# EasyEDA schematic easyeda-schematic.json
TITLE: 2key1 r2; REV: 1.0; Date: 2021-07-10; Sheet: 1/1; Drawn By: softplus; Company: Your Company
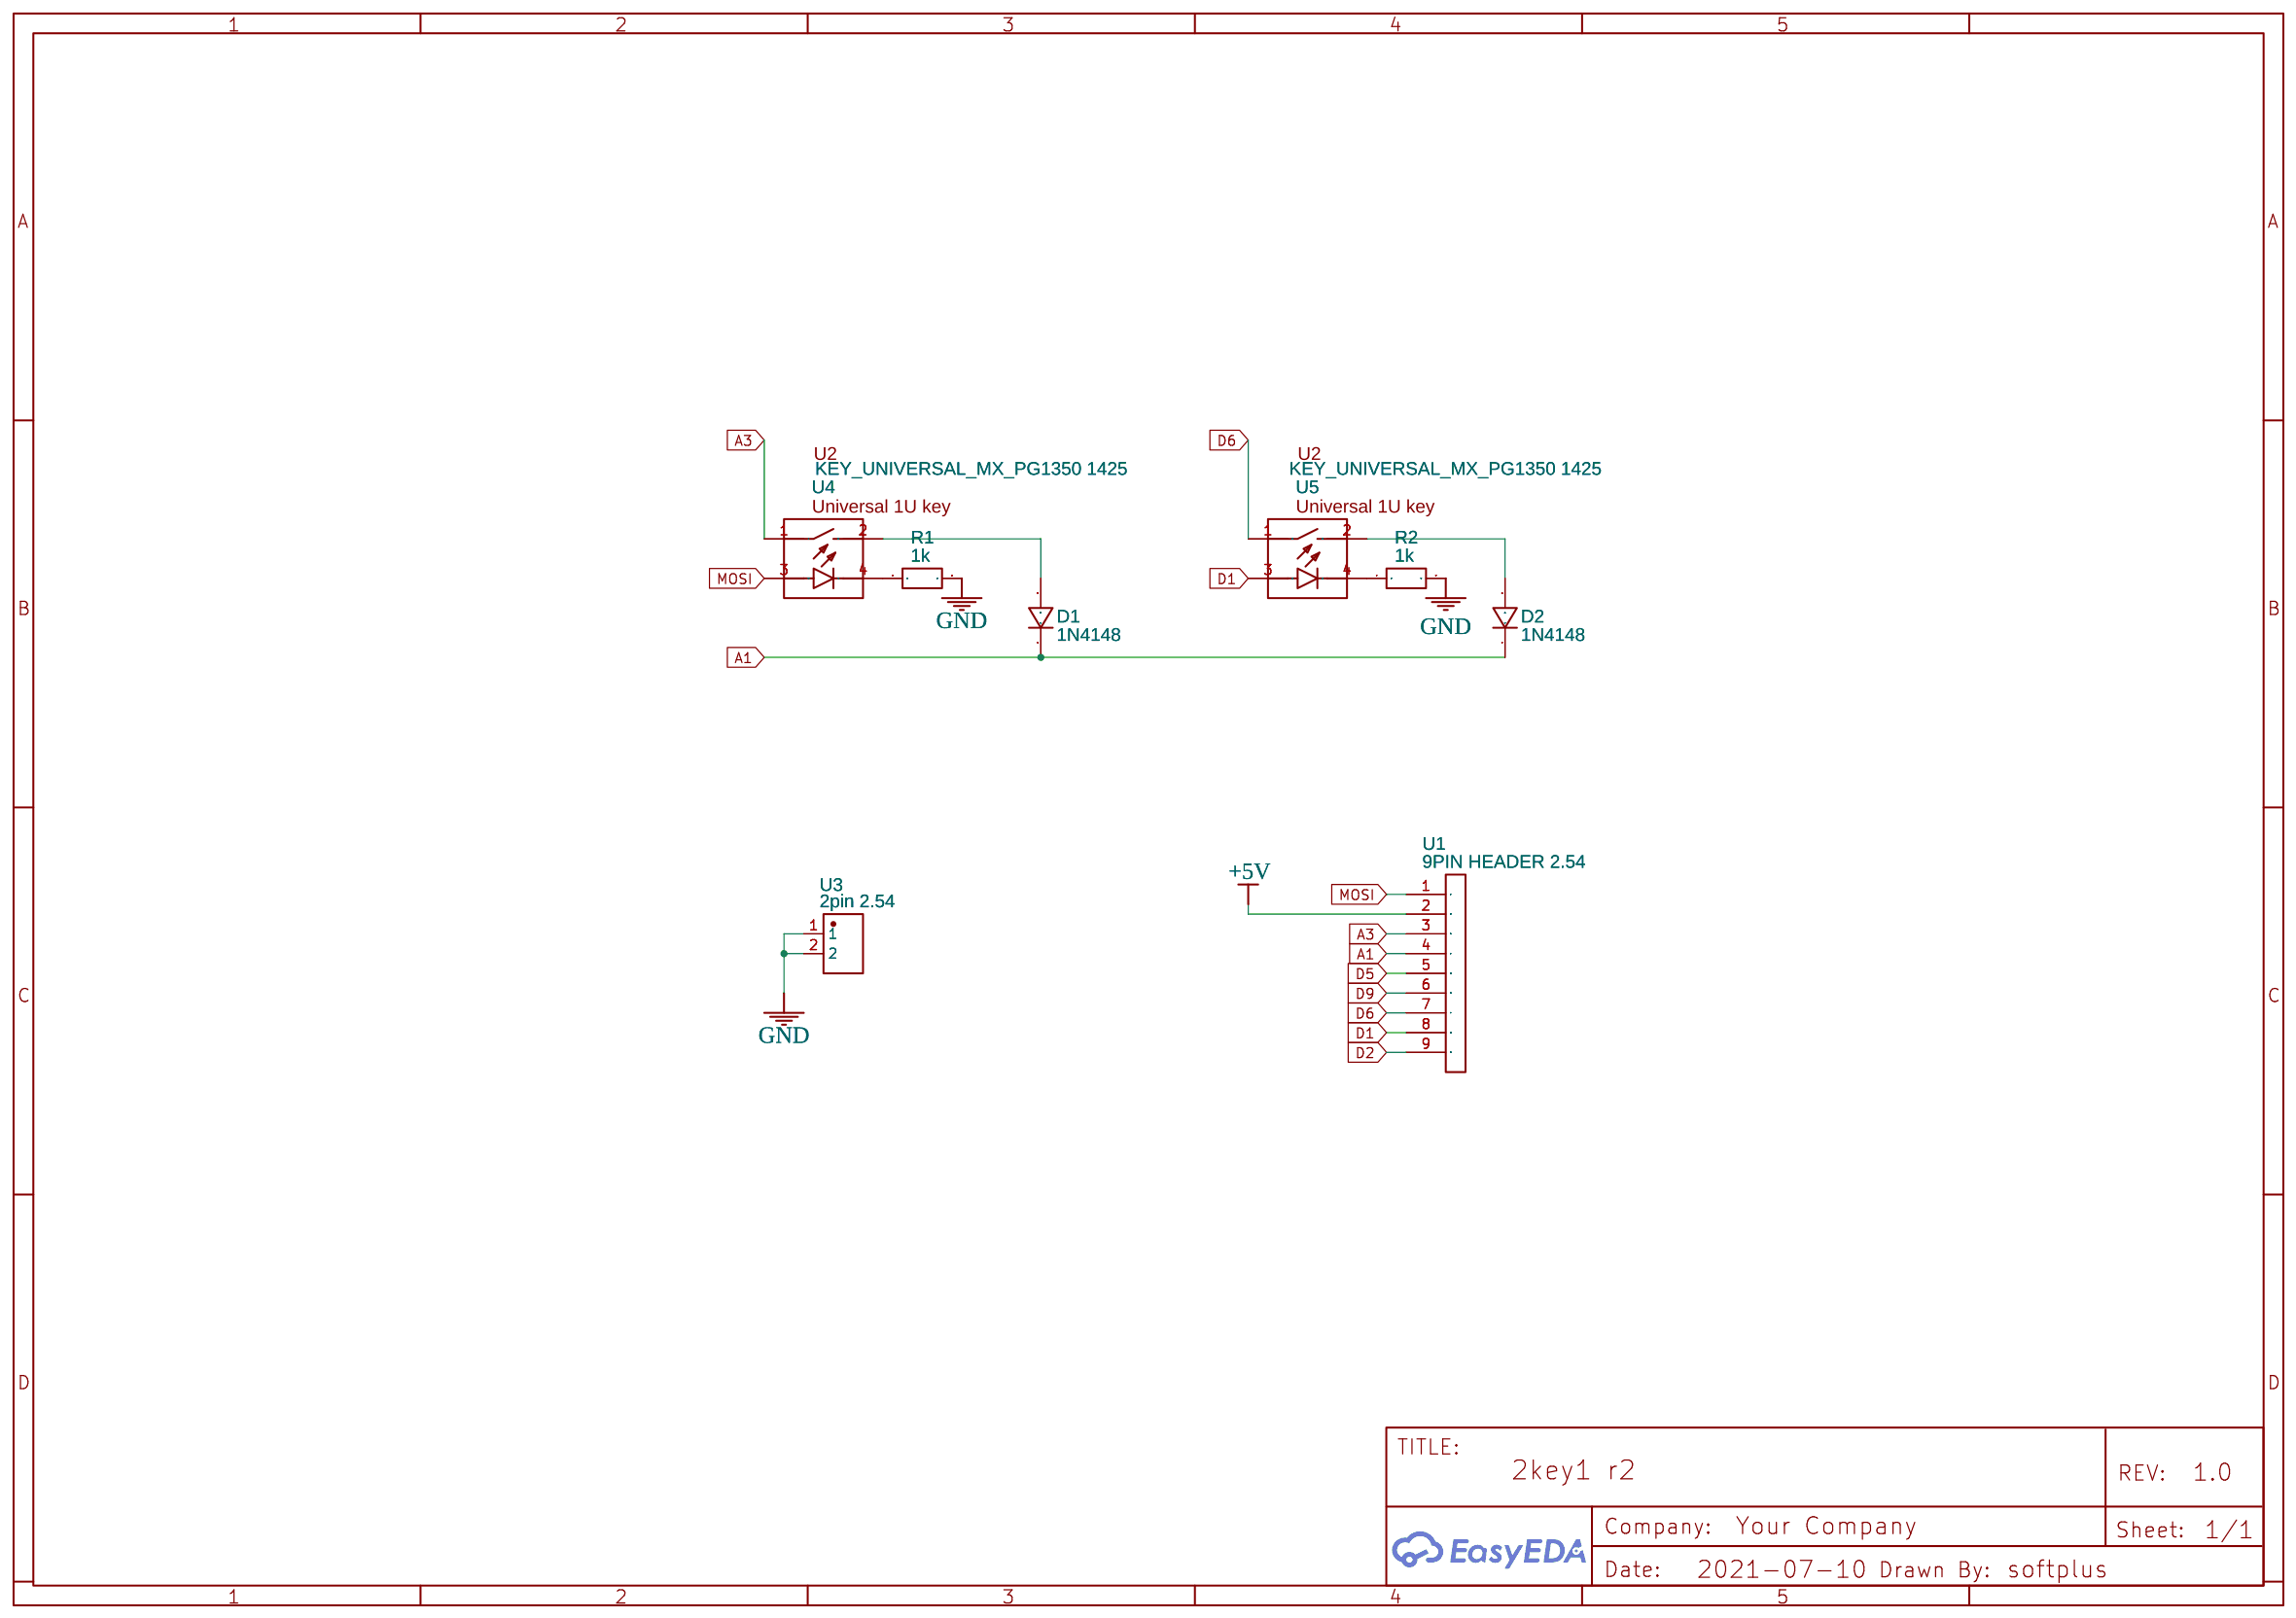
[diagram p0: schematic sheet]

## Parts
D1  1N4148  [SOD-123_L2.8-W1.8-LS3.7-RD]
D2  1N4148  [SOD-123_L2.8-W1.8-LS3.7-RD]
R1  1k  [R0603]
R2  1k  [R0603]
U1  9PIN HEADER 2.54  [9PIN HEADER 2.54]
U3  2pin 2.54  [2PIN HEADER 2.54]
U4  KEY_UNIVERSAL_MX_PG1350 1425  [KEY_UNIVERSAL_MX_PG1350 1425 B]
U5  KEY_UNIVERSAL_MX_PG1350 1425  [KEY_UNIVERSAL_MX_PG1350 1425 B]

## Library data of the parts
D1 D2 = 1N4007W: Supplier: LCSC; Supplier Part: C328592; Manufacturer: BLUE ROCKET; Contributor: LCEDA_Lib
R1 R2 = R_0603_EU: Contributor: LCEDA_Lib
U1 = 9PIN HEADER 2.54: Contributor: johnmu
U3 = 2pin 2.54: Manufacturer Part: 2pin; Contributor: Aero7m1th _; LCSC Assembly: Yes; SMT Type: Extend; Assembly Type: manualWeld; Paste Type: expand
U4 U5 = KEY_UNIVERSAL_MX_PG1350 1425: Contributor: softplus

## Nets
+5V: U1.2
GND: R1.2 R2.2 U3.1 U3.2
A1: D1.1 D2.1 U1.4
A3: U1.3 U4.1
D1: U1.8 U5.3
D2: U1.9
D5: U1.5
D6: U1.7 U5.1
D9: U1.6
MOSI: U1.1 U4.3
Net-(D1-2): D1.2 U4.2
Net-(D2-2): D2.2 U5.2
Net-(R1-1): R1.1 U4.4
Net-(R2-1): R2.1 U5.4
